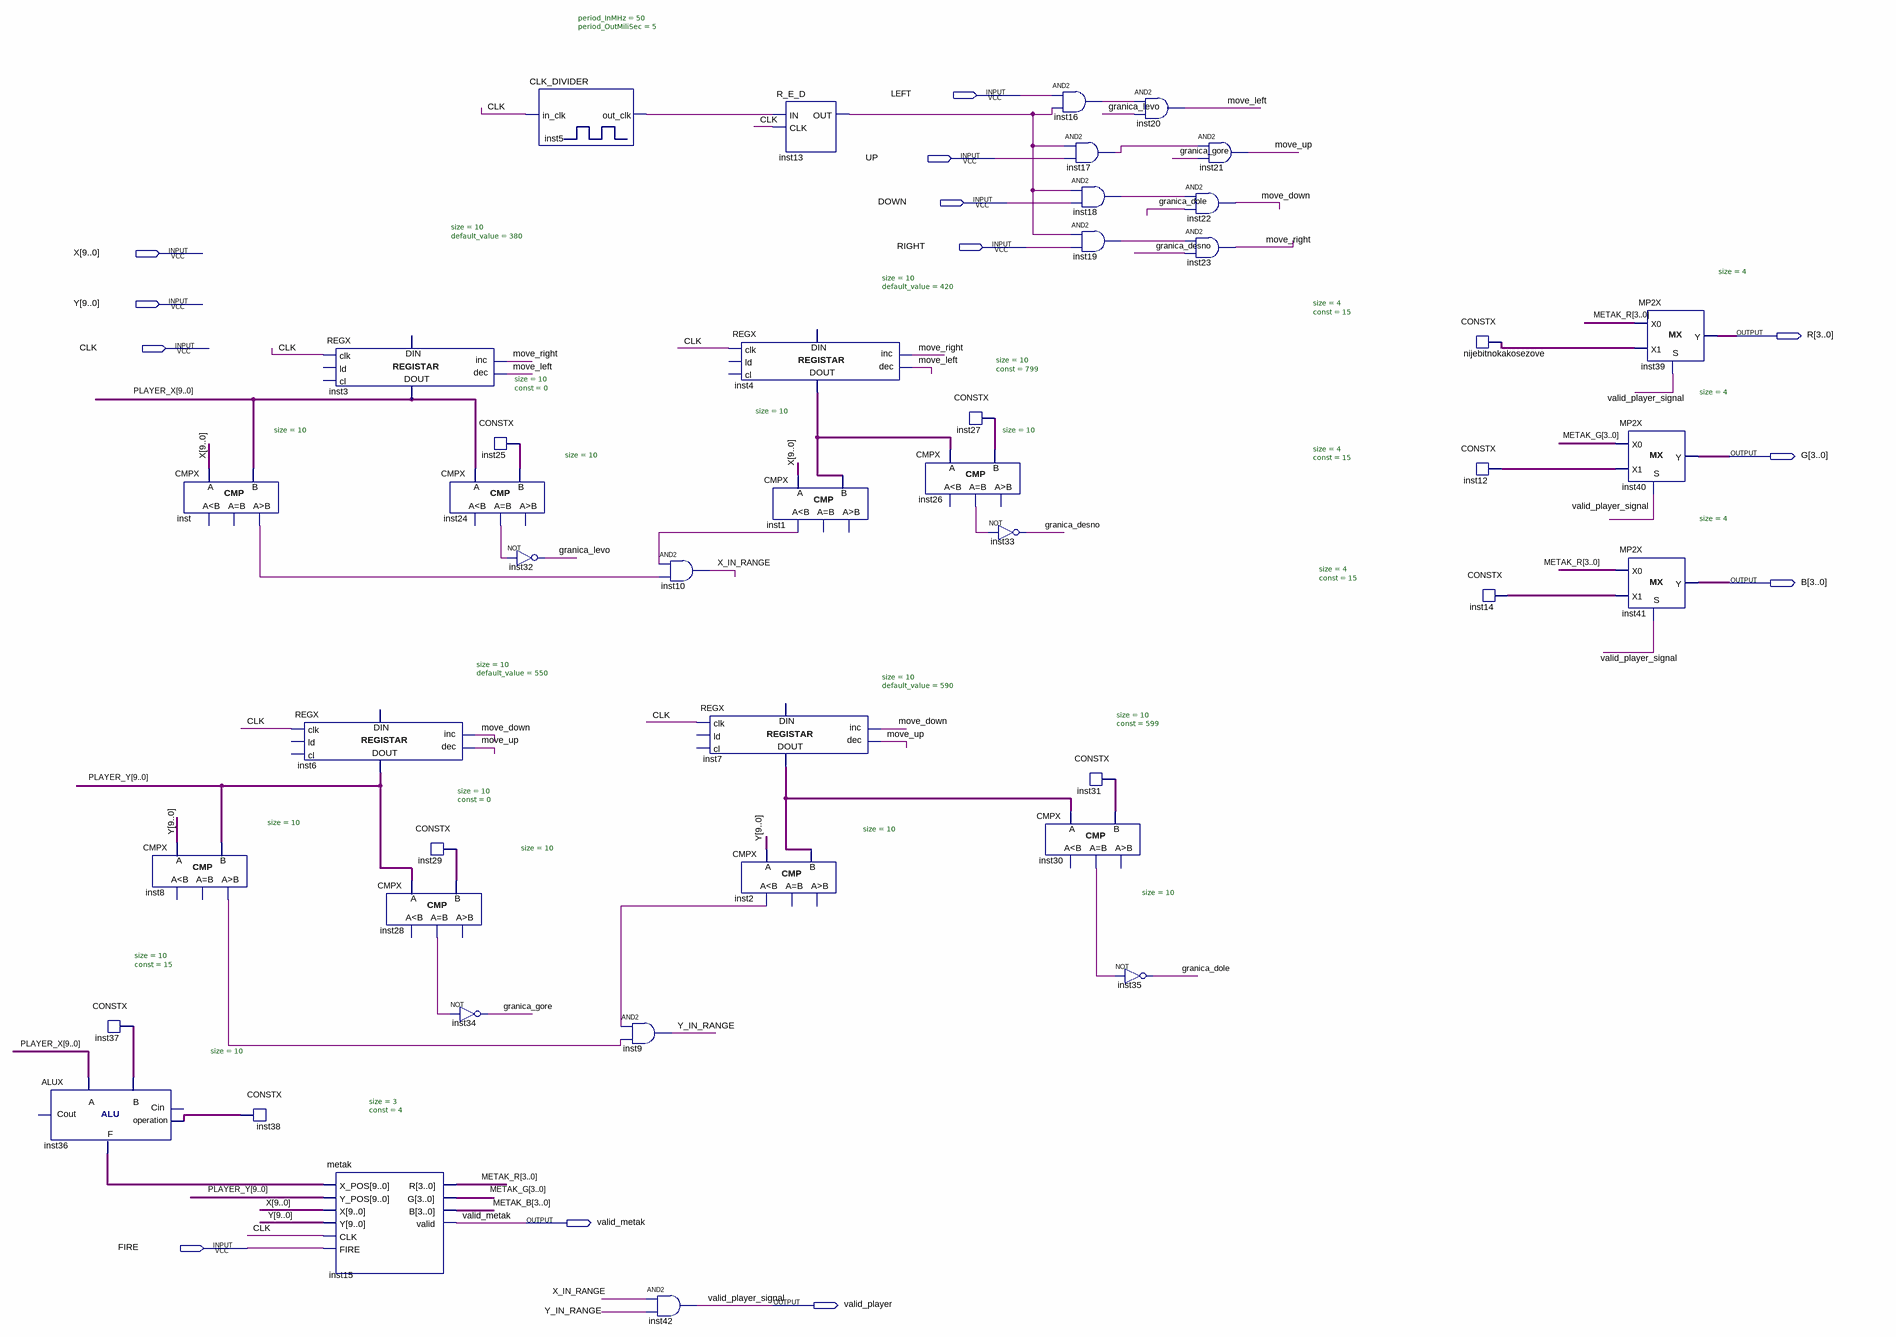
[diagram p0: schematic sheet]
// Quartus schematic Player.bdf as structural Verilog: 43 symbols, 13 pins
module Player (
  input  LEFT,
  input  UP,
  input  DOWN,
  input  RIGHT,
  input  [9:0] X,
  input  [9:0] Y,
  input  CLK,
  input  FIRE,
  output [3:0] R,
  output [3:0] G,
  output [3:0] B,
  output valid_metak,
  output valid_player
);

  wire granica_desno, granica_dole, granica_gore, granica_levo, inst1_ls, inst2_ls, inst5_out_clk, inst8_gr,
       inst13_out, inst16_out, inst17_out, inst18_out, inst19_out, inst24_eq, inst26_eq, inst28_eq,
       inst30_eq, inst_gr, move_down, move_left, move_right, move_up, X_IN_RANGE, Y_IN_RANGE;
  wire [2:0] inst38_data;
  wire [3:0] inst12_data, inst14_data, METAK_B, METAK_G, METAK_R, nijebitnokakosezove_data;
  wire [9:0] inst4_data_out, inst7_data_out, inst25_data, inst27_data, inst29_data, inst31_data, inst36_f,
       inst37_data, PLAYER_X, PLAYER_Y;

  ALUX #(.size(10)) inst36 (.B(inst37_data), .A(PLAYER_X), .op(inst38_data), .F(inst36_f));  // open: Cin, Cout
  CONSTX #(.size(10), .\const (15)) inst37 (.data(inst37_data));
  CMPX #(.size(10)) inst (.A(X), .B(PLAYER_X), .gr(inst_gr));  // open: ls, eq
  CMPX #(.size(10)) inst8 (.A(Y), .B(PLAYER_Y), .gr(inst8_gr));  // open: ls, eq
  CONSTX #(.size(3), .\const (4)) inst38 (.data(inst38_data));
  REGX #(.size(10), .default_value(380)) inst3 (
    .clk(CLK), .inc(move_right), .dec(move_left), .data_out(PLAYER_X));  // open: ld, cl, data_in
  REGX #(.size(10), .default_value(550)) inst6 (
    .clk(CLK), .inc(move_down), .dec(move_up), .data_out(PLAYER_Y));  // open: ld, cl, data_in
  metak inst15 (
    .X_POS(inst36_f), .Y_POS(PLAYER_Y), .X(X), .Y(Y), .CLK(CLK), .FIRE(FIRE), .R(METAK_R), .G(METAK_G),
    .B(METAK_B), .valid(valid_metak));
  CMPX #(.size(10)) inst28 (.A(PLAYER_Y), .B(inst29_data), .eq(inst28_eq));  // open: ls, gr
  CONSTX #(.size(10), .\const (0)) inst29 (.data(inst29_data));
  CONSTX #(.size(10), .\const (0)) inst25 (.data(inst25_data));
  CMPX #(.size(10)) inst24 (.A(PLAYER_X), .B(inst25_data), .eq(inst24_eq));  // open: ls, gr
  not inst34 (granica_gore, inst28_eq);
  CLK_DIVIDER #(.period_InMHz(50), .period_OutMiliSec(5)) inst5 (.in_clk(CLK), .out_clk(inst5_out_clk));
  not inst32 (granica_levo, inst24_eq);
  and inst9 (Y_IN_RANGE, inst2_ls, inst8_gr);
  and inst10 (X_IN_RANGE, inst1_ls, inst_gr);
  and inst42 (valid_player, X_IN_RANGE, Y_IN_RANGE);
  REGX #(.size(10), .default_value(420)) inst4 (
    .clk(CLK), .inc(move_right), .dec(move_left), .data_out(inst4_data_out));  // open: ld, cl, data_in
  REGX #(.size(10), .default_value(590)) inst7 (
    .clk(CLK), .inc(move_down), .dec(move_up), .data_out(inst7_data_out));  // open: ld, cl, data_in
  CMPX #(.size(10)) inst2 (.A(Y), .B(inst7_data_out), .ls(inst2_ls));  // open: eq, gr
  R_E_D inst13 (.IN(inst5_out_clk), .CLK(CLK), .OUT(inst13_out));
  CMPX #(.size(10)) inst1 (.A(X), .B(inst4_data_out), .ls(inst1_ls));  // open: eq, gr
  CMPX #(.size(10)) inst26 (.A(inst4_data_out), .B(inst27_data), .eq(inst26_eq));  // open: ls, gr
  CONSTX #(.size(10), .\const (799)) inst27 (.data(inst27_data));
  not inst33 (granica_desno, inst26_eq);
  CMPX #(.size(10)) inst30 (.A(inst7_data_out), .B(inst31_data), .eq(inst30_eq));  // open: ls, gr
  and inst16 (inst16_out, LEFT, inst13_out);
  and inst17 (inst17_out, inst13_out, UP);
  and inst18 (inst18_out, inst13_out, DOWN);
  and inst19 (inst19_out, inst13_out, RIGHT);
  CONSTX #(.size(10), .\const (599)) inst31 (.data(inst31_data));
  and inst20 (move_left, inst16_out, granica_levo);
  not inst35 (granica_dole, inst30_eq);
  and inst22 (move_down, inst18_out, granica_dole);
  and inst23 (move_right, inst19_out, granica_desno);
  and inst21 (move_up, inst17_out, granica_gore);
  CONSTX #(.size(4), .\const (15)) nijebitnokakosezove (.data(nijebitnokakosezove_data));
  CONSTX #(.size(4), .\const (15)) inst12 (.data(inst12_data));
  CONSTX #(.size(4), .\const (15)) inst14 (.data(inst14_data));
  MP2X #(.size(4)) inst39 (.S(valid_player), .X0(METAK_R), .X1(nijebitnokakosezove_data), .Y(R));
  MP2X #(.size(4)) inst40 (.S(valid_player), .X0(METAK_G), .X1(inst12_data), .Y(G));
  MP2X #(.size(4)) inst41 (.S(valid_player), .X0(METAK_R), .X1(inst14_data), .Y(B));

  // Other names for the same wires on the sheet: valid_player_signal = valid_player
endmodule
